# Altium schematic sheet Sheet1_wiekszy.SchDoc
size A3; SheetNumber: 1; SheetTotal: 2
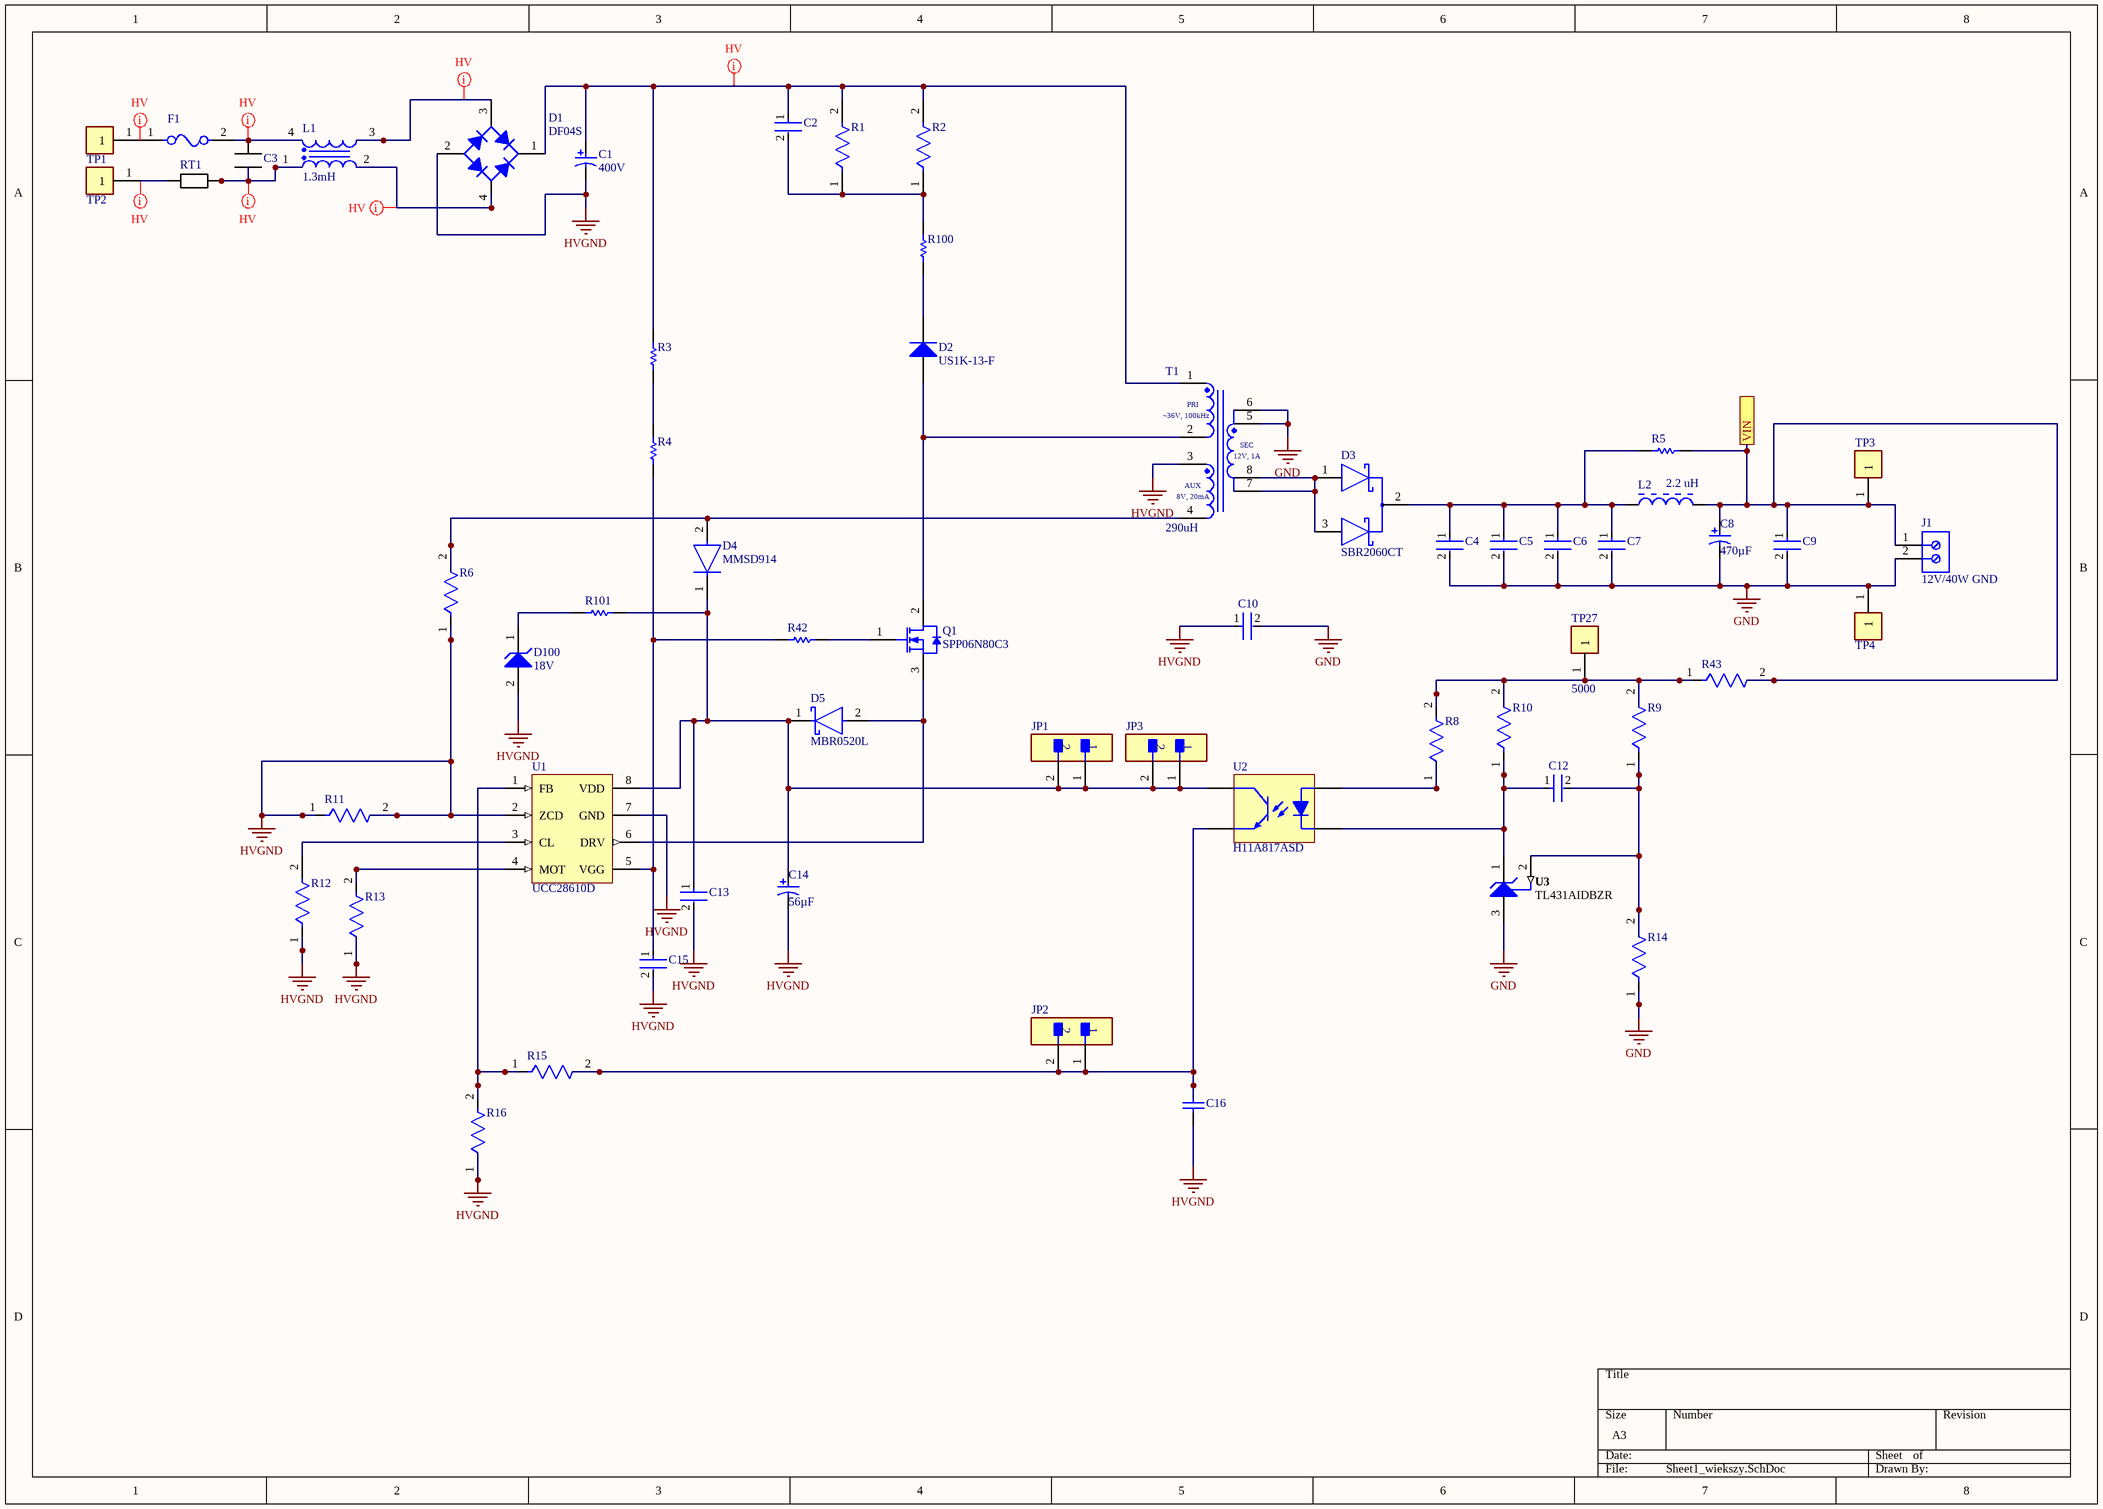
[diagram p0: Sheet1_wiekszy.SchDoc]

## Parts
C1  400V  [NIC-LGU-30x30-2_V]
C2  C1206C103K2RACTU  [FP-C1206C-EB-MFG]  (value not drawn)
C3  cap_0.689 x 0.217  [PCBComponent_1]  (value not drawn)
C4  1210YD226KAT2A  [FP-1210-L_3_3_0_4-W_2_5_0-MFG]  (value not drawn)
C5  1210YD226KAT2A  [FP-1210-L_3_3_0_4-W_2_5_0-MFG]  (value not drawn)
C6  1210YD226KAT2A  [FP-1210-L_3_3_0_4-W_2_5_0-MFG]  (value not drawn)
C7  1210YD226KAT2A  [FP-1210-L_3_3_0_4-W_2_5_0-MFG]  (value not drawn)
C8  Capacitance: 470µF  [PNSC-FK-V-F_V]  (hidden comment: EEEFK1C471P)
C9  C0603X104K5RACTU  [FP-C0603-CJ-MFG]  (value not drawn)
C10  (no value)  [FP-CL31-IPC_C]
C12  CC0603KRX7R9BB223  [FP-CC0603-DA-MFG]  (value not drawn)
C13  C0603X104K5RACTU  [FP-C0603-CJ-MFG]  (value not drawn)
C14  Capacitance: 56µF  [PNSC-FK-V-F_V]  (hidden comment: EEEFK1C471P)
C15  C0603X104K5RACTU  [FP-C0603-CJ-MFG]  (value not drawn)
C16  GRM1885C1H101JA01D  [CAPC1608X90X35NL10T15]  (value not drawn)
D1  DF04S  [FAIR-SDIP-4_V]
D2  US1K-13-F  [DIOD-SMA-2_A_V]
D3  SBR2060CT  [FP-340CC-MFG]
D4  MMSD914  [FP-425-04-MFG]
D5  MBR0520L  [FP-MA02A-MFG]
D100  18V  [ONSC-SMB-2-403A-03_H_V]
F1  0154004.DR  [FP-0154-MFG]  (value not drawn)
J1  12V/40W GND  [TECO-282836-2_V]
JP1  M22-2510205  [FP-M22-2510205-MFG]  (value not drawn)
JP2  M22-2510205  [FP-M22-2510205-MFG]  (value not drawn)
JP3  M22-2510205  [FP-M22-2510205-MFG]  (value not drawn)
L1  1.3mH  [WE-CMB_Type XXL_L43.5W23.5H43]
L2  Inductance: 2.2 uH  [COIL-RFB0807-2_V]  (hidden comment: RFB0807-2R2L)
Q1  SPP06N80C3  [INF-PG-TO220-3-1]
R1  CRCW2512249KFKEG  [FP-CRCW2512-e3-MFG]  (value not drawn)
R2  CRCW2512249KFKEG  [FP-CRCW2512-e3-MFG]  (value not drawn)
R3  CRCW12063M00FKEA  [RESC3216X60X45ML10T20]  (value not drawn)
R4  CRCW12063M00FKEA  [RESC3216X60X45ML10T20]  (value not drawn)
R5  ERJ14BQFR22U  [RESC3225X70X50ML20T20]  (value not drawn)
R6  RR0816P-1693-D-23D  [FP-RR0816-IPC_A]  (value not drawn)
R8  RR0816P-4991-D-68H  [FP-RR0816-MFG]  (value not drawn)
R9  RR0816P-103-D  [FP-RR0816-MFG]  (value not drawn)
R10  RR0816P-202-D  [FP-RR0816-IPC_A]  (value not drawn)
R11  RR0816P-4992-D-68C  [FP-RR0816-IPC_B]  (value not drawn)
R12  RR0816P-6042-D-76C  [FP-RR0816-IPC_C]  (value not drawn)
R13  RR0816P-104-D  [FP-RR0816-IPC_A]  (value not drawn)
R14  RR0816P-2611-D-41H  [FP-RR0816-IPC_C]  (value not drawn)
R15  RR0816P-203-D  [FP-RR0816-MFG]  (value not drawn)
R16  RR0816P-104-D  [FP-RR0816-IPC_A]  (value not drawn)
R42  CRCW08050000Z0EA  [RESC2013X50X30LL20T20]  (value not drawn)
R43  CRCW06030000Z0EAHP  [FP-CRCW0603-HPe3-MFG]  (value not drawn)
R100  CRCW120651R1FKEA  [RESC3216X60X45NL10T20]  (value not drawn)
R101  RG3216P-8200-B-T1  [RESC3216X50X50LL20T20]  (value not drawn)
RT1  Thermistor  [PCBComponent_1]  (value not drawn)
T1  290uH  [WE-FB_EP10]
TP1  5000  [FP-5000-MFG]  (value not drawn)
TP2  5000  [FP-5000-MFG]  (value not drawn)
TP3  5000  [FP-5000-MFG]  (value not drawn)
TP4  5000  [FP-5000-MFG]  (value not drawn)
TP27  5000  [FP-5000-MFG]
U1  UCC28610D  [D0008A_N]
U2  H11A817ASD  [FAIR-H11A817ASD-4_V]
U3  TL431AIDBZR  [DBZ0003A_L]

## Ports
VIN (see Sheet1[3A], Sheet1[3B], Sheet1[5C], Sheet1[7A], Sheet1[7B])

## Nets
GND: C4.2 C5.2 C6.2 C7.2 C8.2 C9.2 C10.2 J1.2 R14.1 T1.5 T1.6 TP4.1 U3.3(ANODE)
HVGND: C1.2 C10.1 C13.2 C14.2 C15.2 C16.1 D1.2(A) D100.2(A) R6.1 R11.1 R11.2 R12.1 R13.1 R16.1 T1.3 U1.2(ZCD) U1.7(GND)
VIN: C8.1 C9.1 J1.1 L2.2 R5.2 R43.2 TP3.1 ; port VIN
NetC1_1: C1.1 C2.1 D1.1(K) R1.2 R2.2 R3.2 T1.1
NetC2_2: C2.2 R1.1 R2.1 R100.2
NetC3_1: C3.1 L1.1 RT1.2
NetC3_2: C3.2 F1.2 L1.4
NetC4_1: C4.1 C5.1 C6.1 C7.1 D3.2(COMMON_CATHODE) L2.1 R5.1
NetC12_1: C12.1 R10.1 U2.2(CATHODE) U3.1(CATHODE)
NetC12_2: C12.2 R9.1 R14.2 U3.2(REF)
NetC13_1: C13.1 C14.1 D4.1(C) D5.1(C) JP1.1 JP1.2 JP3.1 JP3.2 R101.2 U1.8(VDD) U2.4(COLLECTOR)
NetC15_1: C15.1 R4.1 R42.1 U1.5(VGG)
NetC16_2: C16.2 JP2.1 JP2.2 R15.2 U2.3(EMITTER)
NetD1_3: D1.3(C) L1.3
NetD1_4: D1.4(C) L1.2
NetD2_1: D2.1(A) Q1.2(DRAIN) T1.2
NetD2_2: D2.2(K) R100.1
NetD3_1: D3.1(1_ANODE) D3.3(2_ANODE) T1.7 T1.8
NetD4_2: D4.2(A) R6.2 T1.4
NetD5_2: D5.2(A) Q1.3(SOURCE) U1.6(DRV)
NetD100_1: D100.1(K) R101.1
NetF1_1: F1.1 TP1.1
NetQ1_1: Q1.1(GATE) R42.2
NetR3_1: R3.1 R4.2
NetR8_1: R8.1 U2.1(ANODE)
NetR8_2: R8.2 R9.2 R10.2 R43.1 TP27.1
NetR12_2: R12.2 U1.3(CL)
NetR13_2: R13.2 U1.4(MOT)
NetR15_1: R15.1 R16.2 U1.1(FB)
NetRT1_1: RT1.1 TP2.1

## Layout directives
rule Clearance Constraint [Clearance = 49.213mil]: NetC1_1, NetC3_1, NetC3_2, NetD1_3, NetD1_4, NetF1_1, NetRT1_1

## Notes on the sheet
- (in symbol CMP-1360-00018-2) ~36V, 100kHz; PRI; SEC; 12V, 1A; AUX; 8V, 20mA

## Library data of the parts
C1 = CMP-1233-00001-1: Aluminum Electrolytic Capacitor, 180 uF +/-20%, 400 V, -25 to 105 degC, 2-Pin THD, RoHS; PartNumber: LGU2G181MELB; Manufacturer: Nichicon; Rated Capacitance: 180 uF; Rated Ripple: 980 mA; Leakage Current: 0.8 mA; ComponentLink2URL: http://nichicon-us.com/english/products/pdfs/e-gu.pdf; DatasheetVersion: Sep-13; ComponentLink1Description: Manufacturer URL; Rated Voltage: 400 V; PackageDescription: 2-Pin Through Hole Device, Dia 30 mm, Body Length 30 mm, Pin Spacing 10 mm; ComponentLink1URL: http://www.nichicon.co.jp/; Mounting Technology: Through Hole; ComponentLink2Description: Datasheet; ComponentLink3URL: http://nichicon-us.com/english/products/pdfs/e-gu.pdf; RoHS: TRUE; Temperature Range: -25 to 105 degC; Capacitance Tolerance: +/-20%; ComponentLink3Description: Package Specification
C2 = CMP-1037-03529-2: CAP CER 10000PF 200V X7R 1206; Manufacturer: KEMET; Value: 10,000 pF; Automotive Grade: Grade 0; Temperature Coefficient: 15%; Material: Ceramic; Tolerance: 0.1; Temperature Range High: +150°C; Category: Cap; Device Class L2: Capacitors; Temperature Range Low: -55°C; Temperature Characteristic: X7R; Lead Free: Yes; Octopart: https://octopart.com/c1206c103k2ractu-kemet-2299149; Device Class L1: Passive Components; RoHS: TRUE; Mouser Description: Multilayer Ceramic Capacitors MLCC - SMD/SMT 200volts 10000pF X7R 10%; Temperature: -55°C to +150°C; Voltage Rating: 200 V; ComponentLink2URL: https://content.kemet.com/datasheets/KEM_C1007_X8R_ULTRA_150C_SMD.pdf; Ipc Land Pattern Name: CAPC320160X78; Automotive: Yes; Device Class L3: Ceramic Capacitors; Manufacturer Part Number: C1206C103K2RACTU; Digikey Description: CAP CER 10000PF 200V X7R 1206; Capacitance: 10,000 pF; Package: C1206C-EB; ComponentLink2Description: Datasheet; Height: 0.88mm
C3 = cap_0.689 x 0.217: 0.22 uF Capacitor, Film, 250VAC, 20%; Manufacturer: Panasonic; Manufactured Part Number: STD; Tolerance: 20%; Package Size: 0.689 x 0.217; Voltage Rating: 250VAC
C4-C7 = CMP-2000-05483-2: General Purpose Ceramic Capacitor, 1210, 22uF, 10%, X5R, 15%, 16V; Tolerance: 10%; Width: 0.098inch; Length: 3.2mm; Min Operating Temperature: -55°C; Capacitance: 22uF; Case/Package: 1210; Termination: SMD/SMT; Voltage: 16V; Number of Pins: 2; Thickness: 0.11inch; Height: 2.79mm; Weight: 0.000564oz; Case Code (Imperial): 1210; Contact Plating: Tin; Lead Free: Lead Free; RoHS Compliant: Yes; Packaging: Tape and Reel; Package Quantity: 1; Construction: Flat; Series: -; REACH SVHC: No SVHC; Case Code (Metric): 3225; Size: 2.79mm; Radiation Hardening: No; Voltage Rating: 16V; Depth: 2.5mm; Mount: Surface Mount; Voltage Rating (DC): 16V; Dielectric: X5R; Max Operating Temperature: 85°C
C8 C14 = CMP-2000-06204-1: Aluminum Electrolytic Capacitor, 470 uF, +/- 20%, 16 V, 2-Pin SMD (Size Code F), -55 to 105 degC, RoHS, Tape and Reel; Manufacturer: Panasonic; Type: Can; Ripple Current: 600mA; Lifetime@Temperature: 2000Hrs@105°C; Impedance: 0.16O; Rated Voltage: 16V; Manufacturer URL: http://www.panasonic.com/; Package Description: 2-Pin Electrolytic Aluminum Capacitor, Body 8.3 x 8.3 mm; Operating Temp-Max: 105°C; Mounting Technology: SurfaceMount; Operating Temp Range: -55to+105°C; Datasheet Version: 03/2016; Series: FK; Package Reference: FK-V-F; Case Size/Dimension: Ø8x10.2mm; Package URL: http://industrial.panasonic.com/cdbs/www-data/pdf/RDE0000/DME0000COL48.pdf; Datasheet URL: http://industrial.panasonic.com/cdbs/www-data/pdf/RDE0000/ABA0000C1181.pdf
C9 C13 C15 = CMP-2006-03300-2: CAP CER 0.1UF 50V X7R 0603; Manufacturer: Kemet; Capacitance: 100nF; Material: Ceramic; Tolerance: 10%; Value: 100nF; Temperature Coefficient: 15%; Temperature Range High: +125°C; Temperature Range Low: -55°C; Manufacturer Part Number: C0603X104K5RACTU; Voltage: 50V; ComponentLink2Description: Datasheet; RoHS: TRUE; ComponentLink2URL: https://content.kemet.com/datasheets/KEM_C1013_X7R_FT-CAP_SMD.pdf; Device Class L3: Ceramic Capacitors; Device Class L2: Capacitors; Package: C0603-CJ; Height: 0.95mm; Device Class L1: Passive Components; Temperature Characteristic: X7R; Lead Free: Yes; Digikey Description: CAP CER 0.1UF 50V X7R 0603; Automotive: No; Mouser Description: Capacitor; Ceramic; Cap 0.1uF; Tol+10%; SMT; Flexible Termination; Vol-Rtg 50V; TR; Temperature: -55°C to +125°C; Octopart: https://octopart.com/c0603x104k5ractu-kemet-9145062; Category: Cap; Voltage Rating: 50V; Ipc Land Pattern Name: CAPC16080X80
C10 = CMP-13271-001384-1: Cap Ceramic 1.5nF 500V X7R ±10% SMD 1206 +125°C Embossed T/R; Max Operating Temperature: 125°C; Radiation Hardening: No; Width: 0.063inch; Dielectric: X7R; Case Code (Metric): 3216; Length: 3.2mm; Voltage Rating (DC): 500V; Package Quantity: 1; Voltage Rating: 500V; Mount: Surface Mount; Min Operating Temperature: -55°C; Case Code (Imperial): 1206; Packaging: Tape and Reel; Capacitance: 1.5nF; Voltage: 500V; Thickness: 0.055inch; Case/Package: 1206; Height: 1.25mm; Depth: 1.6mm; Tolerance: 10%
C12 = CMP-2100-03602-3: CAP CER 0.022UF 50V X7R 0603; Dielectric Material: Ceramic; Insulation Resistance: 100GR; Tolerance: 10%; Capacitance: 22nF; Thickness: 0.035inch; Case/Package: 0603; Packaging: Tape and Reel; Voltage Rating (DC): 50V; Length: 1.6mm; Depth: 0.8mm; Dielectric: X7R; Resistor Type: Ceramic; Min Operating Temperature: -55°C; Number of Pins: 2; Series: CC; Mount: Surface Mount; Max Operating Temperature: 125°C; Case Code (Imperial): 0603; Width: 0.031inch; Halogen Free: Halogen Free; Lead Free: Lead Free; Voltage: 50V; RoHS Compliant: Yes; Package Quantity: 1; Height: 0.8mm; REACH SVHC: No SVHC; Voltage Rating: 50V; Case Code (Metric): 1608; Termination: SMD/SMT; Radiation Hardening: No
C16 = CMP-2006-02595-1: Manufacturer: Murata; Part Number: GRM1885C1H101JA01D
D1 = CMP-2000-06151-1: Bridge Rectifier, 1.5 A, 400 V, -55 to 150 degC, 4-Pin SMD, RoHS, Tape and Reel; Vf - Forward Voltage: 1.1V; Vr - Reverse Voltage: 280V; Max Surge Current: 50A; Peak Reverse Voltage: 400V; Brand: FairchildSemiconductor; Pd - Power Dissipation: 3.1W; If - Forward Current: 1.5A; Unit Weight: 0.017073oz; Ir - Reverse Current: 50uA; Minimum Operating Temperature: -55C; Datasheet URL: https://www.fairchildsemi.com/datasheets/DF/DF005S.pdf; Product: SinglePhaseBridge; Maximum Operating Temperature: +150C; Datasheet Version: Rev. 1.5 , 05/2015; Product Category: BridgeRectifiers; Packaging: Reel; Length: 8.5mm; Mounting Technology: SurfaceMount; Package Reference: SDIP 4L; Package Description: 4-Pin Surface Mount Device, Body 8.28 x 6.35 mm, Pitch 5.1 mm; Manufacturer: FairchildSemiconductor; Mounting Style: ThroughHole; Package / Case: SDIP-4; RoHS: True; Height: 3.3mm; Manufacturer URL: https://www.fairchildsemi.com/; Width: 6.5mm
D2 = CMP-1667-00001-4: Ultra-Fast Rectifier, 1 A, 1.7 V, -65 to 150 degC, 2-Pin SMD, RoHS, Tape and Reel; Manufacturer: Diodes Inc; ComponentLink2Description: Datasheet; PackageDescription: 2-Pin Surface Mount Device, Body 4.3 x 2.605 mm; Height: 2.1 mm; REACH SVHC: Yes; RoHSCompliant: true; Min Operating Temperature: -65 degC; Pins: 2; Packaging: Cut Tape; ComponentLink2URL: http://www.diodes.com/_files/datasheets/ds16008.pdf; Package Quantity: 1; Length: 4.6 mm; Max Operating Temperature: 150 degC; ComponentLink1URL: http://www.diodes.com/; ComponentLink1Description: Manufacturer URL; DatasheetVersion: Rev. 11-2, 12/2014; PackageReference: SMA-2; Mount: Surface Mount; Mounting Technology: Surface Mount
D3 = CMP-00278-84329774-2: MBR3060PT Rectifier Diode, Schottky, 1 Phase, 2 Element, 30A, 60V V(RRM), Silicon, TO-247AD; Manufacturer Lifecycle Status: OBSOLETE; Peak Non-Repetitive Surge Current: 200A; Forward Voltage: 750mV; Max Reverse Leakage Current: 5mA; Element Configuration: Common Cathode; Max Junction Temperature (Tj): 150°C; Mount: Through Hole; NexarPartId: 84329774; Weight: 5.508g; RoHS: Compliant; Width: 5.22mm; Max Operating Temperature: 150°C; Lead Free: Lead Free; Max Forward Surge Current (Ifsm): 200A; Lifecycle Status: Obsolete; Max Repetitive Reverse Voltage (Vrrm): 60V; Number of Pins: 3; Average Rectified Current: 30A; REACH SVHC: No SVHC; Peak Reverse Current: 5mA; Length: 16.4mm; Radiation Hardening: No; Max Reverse Voltage (DC): 60V; Voltage Rating (DC): 60V; Min Operating Temperature: -65°C; Forward Current: 30A; Height: 21.3mm; Current Rating: 30A; Max Surge Current: 200A
D4 = CMP-00278-20848306-1: MMSD914 Rectifier Diode Small Signal Switching 100V 0.2A 4ns 2-Pin SOD-123 T/R; Manufacturer Lifecycle Status: LAST SHIPMENTS; Max Surge Current: 2A; Average Rectified Current: 200mA; Power Dissipation: 400mW; Forward Voltage: 1V; Element Configuration: Single; Peak Reverse Current: 5µA; Polarity: Standard; Max Junction Temperature (Tj): 150°C; Max Forward Surge Current (Ifsm): 500mA; Capacitance: 4pF; Min Operating Temperature: -55°C; Max Operating Temperature: 150°C; Termination: SMD/SMT; Schedule B: 8541100070; Recovery Time: 4ns; Output Current: 200mA; Voltage Rating (DC): 100V; Number of Pins: 2; Mount: Surface Mount; Max Reverse Voltage (DC): 100V; NexarPartId: 20848306; REACH SVHC: No SVHC; Reverse Voltage: 100V; RoHS: Compliant; Max Repetitive Reverse Voltage (Vrrm): 100V; Weight: 30mg; Contact Plating: Tin; Lead Free: Lead Free; Height: 1.18mm; Width: 1.8mm; Reverse Recovery Time: 4ns; Lifecycle Status: EOL; Length: 2.85mm; Packaging: Tape & Reel; Forward Current: 200mA; Current Rating: 200mA; Peak Non-Repetitive Surge Current: 2A; Radiation Hardening: No
D5 = CMP-2000-04926-2: DIODE SCHOTTKY 20V 500MA SOD123; Current Rating: 500A; Peak Non-Repetitive Surge Current: 5.5A; Peak Reverse Current: 250uA; Power Dissipation: 400mW; Polarity: Standard; Element Configuration: Single; Capacitance: 4pF; Forward Voltage: 385mV; Voltage Rating (DC): 20V; Max Reverse Voltage (DC): 20V; Packaging: Tape and Reel; Min Operating Temperature: -65°C; Max Repetitive Reverse Voltage (Vrrm): 20V; Forward Current: 500mA; Max Operating Temperature: 125°C; Width: 1.6mm; Height: 1.03mm; Max Forward Surge Current (Ifsm): 5.5A; Mount: Surface Mount; Max Reverse Leakage Current: 250uA; Weight: 0.03g; Package Quantity: 3000; Max Surge Current: 5.5A; Radiation Hardening: No; REACH SVHC: No SVHC; Average Rectified Current: 500mA; Output Current: 500mA; Length: 2.7mm; Number of Pins: 2; Lead Free: Lead Free
D100 = CMP-1060-00156-1: 3 W Zener Voltage Regulator, 2-Pin SMB, Tape and Reel; Manufacturer: On Semiconductor; PartNumber: 1SMB5931BT3; VZ Typ (V): 18; ComponentLink1Description: Manufacturer URL; DatasheetVersion: Rev. 8; Mounting Technology: Surface Mount; ComponentLink2Description: Datasheet; PackageVersion: Rev. H, 05/2011; ComponentLink1URL: http://www.onsemi.com/; Packing: Tape and Reel; ComponentLink3URL: http://www.onsemi.com/pub_link/Collateral/1SMB5913BT3-D.PDF; ComponentLink2URL: http://www.onsemi.com/pub_link/Collateral/1SMB5913BT3-D.PDF; PackageReference: SMB-2-403A-03_H; ComponentLink3Description: Package Specification; PackageDescription: 2-Pin Small Molded Package, J-Bend Lead, Body 4.33 x 3.625 mm
F1 = CMP-08605-000003-1: FUSE BRD MNT 4A 125VAC/VDC 2SMD; Manufacturer: Littelfuse; Fuse Blow Speed: Fast; Max Fuse Ac Voltage: 125V; Lead Free: Yes; Device Class L3: unset; Manufacturer Part Number: 0154004.DR; Device Class L2: Fuses; Package: 0154; ComponentLink2Description: Datasheet; Temperature Range Low: -55°C; Temperature Range High: +125°C; Device Class L1: Circuit Protection; Height: 3.81mm; Temperature: -55°C to +125°C; Mouser Description: Surface Mount Fuses Fuseblock w/ fuse 4A OMNI BLOK 154; Automotive: No; Digikey Description: FUSE BRD MNT 4A 125VAC/VDC 2SMD; RoHS: TRUE; Category: Fuse; Fuse Current: 4A; Max Fuse Dc Voltage: 125V; ComponentLink2URL: https://www.littelfuse.com/~/media/electronics/datasheets/fuses/littelfuse_fuse_154_154t_154l_154tl_datasheet.pdf.pdf; Octopart: https://octopart.com/0154004.dr-littelfuse-565861
J1 = CMP-1684-00017-1: Female Header, Pitch 5 mm, 1 x 2 Position, Height 10 mm, Tail Length 3.5 mm, Rohs, Bulk; Manufacturer: TE Connectivity; Wire Gauge: 16-30AWG; Product Training Modules: Wire-to-BoardEurostyleTerminalBlocks; Clamp Material - Plating: Brass-NickelPlated; Voltage: 300V; Mating Orientation: HorizontalwithBoard; Current: 13.5A; Pitch: 0.197"(5.00mm); Screw Thread: M3; 3D Model: 282836-2.pdf; Other Names: 5ULV-02B / A98076; Dynamic Catalog: BuchananSeries; Number of Levels: 1; Torque - Screw: 0.68Nm(6Lb-In); Featured Product: EurostyleTerminalBlockConnectors; Positions Per Level: 2; Wire Termination: Screw-RisingCageClamp; Datasheet URL: http://www.te.com.cn/commerce/DocumentDelivery/DDEController?Action=showdoc&DocId=Catalog+Section%7F1308389_EUROSTYLE_TERMINAL_BLOCKS%7F0607%7Fpdf%7FEnglish%7FENG_CS_1308389_EUROSTYLE_TERMINAL_BLOCKS_0607.pdf%7F282836-2; Color: Green; Family: TerminalBlocks-WiretoBoard; RoHS Information: 282836-2StatementofCompliance; Standard Package: 300; Contact Material - Plating: Brass-TinPlated; Manufacturer URL: http://www.te.com; Housing Material: Polyamide(PA66),Nylon6/6; Features: Interlocking(Side); Package Description: Female Header, Pitch 5 mm, 1 x 2 Position, Height 10 mm, Tail Length 3.5 mm; Mounting Type: ThroughHole; Package Reference: THD; Packaging: Bulk; Series: Buchanan; Category: Connectors,Interconnects; Screw Material - Plating: Brass-NickelPlated
JP1-JP3 = CMP-15831-000005-1: CONN HEADER VERT 2POS 2MM; Manufacturer: Harwin; Conn Gender: Male; Current Rating: 2A; Number Of Contacts: 2; Conn Orientation: Vertical; Temperature Range Low: -40°C; Device Class L1: Connectors; ComponentLink2URL: https://cdn.harwin.com/pdfs/C018XX_M22_Series_Connectors.pdf; Temperature Range High: +105°C; Pitch: 2mm; Number Of Rows: 1; Temperature: -40°C to +105°C; Automotive: No; Device Class L3: unset; Octopart: https://octopart.com/m22-2510205-harwin-2538221; Mouser Description: Headers & Wire Housings 2 PIN SIL VERTICAL GOLD PIN HEADER; Height: 5.45mm; Category: Conn; Digikey Description: CONN HEADER VERT 2POS 2MM; Contact Material: Gold,Nickel; Lead Free: Yes; ComponentLink2Description: Datasheet; Manufacturer Part Number: M22-2510205; Device Class L2: Headers and Wire Housings; Package: 0; Footprint Url: https://cdn.harwin.com/pdfs/M22-251.pdf; RoHS: TRUE
L1 = CMP-0223-00119-2: NexarPartId: 8917427; Resistance: 6.2MΩ; Number of Lines: 2; Pin Length: 3mm; Self Resonant Frequency: 10kHz; Lead Diameter: 1.8mm; Current: 20A; Tolerance: 30%; Series Resistance: 4.7mΩ; Test Frequency: 50Hz; Core Material: Ferrite; Voltage Rating: 250V; REACH SVHC: No SVHC; Width: 23.5mm; Mount: Radial, Through Hole; Ambient Temperature Range Low: -40°C; Number of Pins: 4; Depth: 23.5mm; Termination: Radial; Ambient Temperature Range High: 70°C; DC Resistance (DCR): 6.2mΩ; Max Operating Temperature: 125°C; Min Operating Temperature: -40°C; Inductance Tolerance: 30%; Height: 43mm; Case/Package: Radial; Max DC Current: 20A; Inductance: 1.3mH; Lead Pitch: 10mm; RoHS: Compliant; Current Rating: 20A; Length: 43.5mm
L2 = CMP-0924-00033-1: Power Inductor, 2.2 uH +/- 20%, 6 A, -40 to 125 degC, 2-Pin Radial Leaded, Dia 8.8 mm, RoHS, Tray; Manufacturer: Coilcraft; SRF: 80 MHz Typ.; Tolerance: +/- 20%; DCR: 0.012 Ohm Max.; Isat: 6 A; Irms Rise (40 degC): 7.5 A; Irms Rise (20 degC): 5 A; ComponentLink1URL: http://www.coilcraft.com/; PackageDescription: 2-Pin Radial Leaded, Dia 8.8 mm, Height 7.5 mm, Pin Spacing 5 mm; ComponentLink1Description: Manufacturer URL; PartNumber: RFB0807-2R2L; Mounting Technology: Through Hole; ComponentLink2Description: Datasheet; Ambient Temperature Range: -40 to 125 degC; ComponentLink2URL: http://www.coilcraft.com/pdfs/rfb.pdf; RoHS: TRUE; DatasheetVersion: Sep-13; Packing: Tray; PackageReference: RFB0807-2
Q1 = CMP-1165-00007-1: N-Channel CoolMOS Power-Transistor, 800 V VDS, 6 A ID, -55 to 150 degC, PG-TO220-3-1, Tube, Green; Manufacturer: Infineon; RDS (on) (max): 900Â mOhm; ID (max): 6Â A; QG: 31Â nC; Ptot (max): 83Â W; VGS(th) (max): 3.9Â V; VDS (max): 800Â V; RthJA (max): 62Â K/W; Rth: 1.5Â K/W; VGS(th) (min): 2.1Â V; Polarity: N; IDpuls (max): 18Â A; Packing: Tube; ComponentLink2URL: http://www.infineon.com/dgdl/SPP06N80C3_rev2.91.pdf?folderId=db3a3043163797a6011638491238009b&fileId=db3a30432313ff5e0123a8fd3e665c78; PackageDescription: 3-Pin Plastic (Green) Transistor Single Outline Package, 10 x 9.25 mm Body, 2.54 mm Pitch; Mounting Technology: Through Hole; ComponentLink3Description: Package Specification; PartNumber: SPP06N80C3; Technology: CoolMOS C3; ComponentLink3URL: http://www.infineon.com/dgdl/BTS117_DS_14.pdf?folderId=db3a30431400ef68011421b54e2e0564&fileId=db3a30433a747525013abff8302d549c&location=en.Products.Automotive_ICs.Smart_High-_and_Low-Side_Switches.HITFET___TEMPFET__-_Smart_Low-Side_Switches.DATASHEET.BTS1; DatasheetVersion: Rev. 2.91; ComponentLink1URL: http://www.infineon.com/; ComponentLink2Description: Datasheet; PackageReference: PG-TO220-3-1; ComponentLink1Description: Manufacturer URL; RthJC (max): 1.5Â K/W; PackageVersion: Jul-12
R1 R2 = CMP-1018-00779-2: RES Thick Film, 249kΩ, 1%, 1W, 100ppm/°C, 2512; Voltage Rating: 500V; Resistance: 24.9kR; Power Rating: 500mW; Max Power Dissipation: 1W; Number of Pins: 2; Height: 0.028inch; Width: 0.124inch; Composition: Thick Film; Package Quantity: 2000; Case Code (Imperial): 2512; Voltage Rating (DC): 500V; Tolerance: 1%; Temperature Coefficient: 100ppm/°C; Features: Automotive AEC-Q200; Packaging: Cut Tape; Lead Free: Lead Free; Case Code (Metric): 6432; Case/Package: 2512; Length: 0.248inch; Number of Terminations: 2
R3 R4 = CMP-2003-02164-1: Manufacturer: Vishay Dale; Part Number: CRCW12063M00FKEA
R5 = CMP-2005-03801-1: Manufacturer: Panasonic; Part Number: ERJ14BQFR22U
R6 = CMP-28537-014398-1: 169kΩ ±0.5% 0.0625W 1/16W Chip Resistor 0603 (1608 Metric) Thin Film; Voltage Rating: 75V; Temperature Coefficient: 25ppm/°C; Max Power Dissipation: 63mW; Power Rating: 62.5mW; Resistance: 169kR; Package Quantity: 5000; Case/Package: 0603; Packaging: Tape and Reel; Case Code (Imperial): 0603; RoHS Compliant: Yes; Resistor Type: Thin Film; Min Operating Temperature: -55°C; Termination: SMD/SMT; Voltage Rating (DC): 75V; Case Code (Metric): 1608; Number of Terminations: 2; Max Operating Temperature: 125°C; Width: 0.031inch; Lead Free: Lead Free; Series: RR; Tolerance: 0.5%; Length: 0.063inch; Height: 0.02inch
R8 = CMP-2000-02681-2: 4.99kΩ ±0.5% 0.0625W 1/16W Chip Resistor 0603 (1608 Metric) Thin Film; Voltage Rating: 75V; Power Rating: 63mW; Temperature Coefficient: 25ppm/°C; Resistance: 4.99kR; Case Code (Metric): 1608; Tolerance: 0.5%; Resistor Type: Thin Film; Case Code (Imperial): 0603; Width: 0.031inch; Case/Package: 0603; RoHS Compliant: Yes; Number of Pins: 2; Packaging: Cut Tape; Lead Free: Lead Free; Number of Terminations: 2; Package Quantity: 1; Length: 0.063inch; Height: 0.02inch; Series: RR; Voltage Rating (DC): 75V; Size Code: 0603; Min Operating Temperature: -55°C; Resistance Tolerance: 0.5%; Max Power Dissipation: 63mW; Termination: SMD/SMT; Max Operating Temperature: 125°C
R9 = CMP-2000-02424-2: 10kΩ ±0.5% 0.0625W 1/16W Chip Resistor 0603 (1608 Metric) Thin Film; Max Power Dissipation: 63mW; Voltage Rating (DC): 75V; Resistance: 10kR; Temperature Coefficient: 25ppm/°C; Termination: SMD/SMT; Package Quantity: 1; Weight: 7.1E-05oz; Resistance Tolerance: 0.5%; Case Code (Metric): 1608; Height: 0.4mm; RoHS Compliant: Yes; Number of Terminations: 2; Max Operating Temperature: 125°C; Width: 0.8mm; Resistor Type: Thin Film; Packaging: Tape and Reel; Length: 1.6mm; Min Operating Temperature: -55°C; Depth: 0.8mm; Tolerance: 0.5%; Size Code: 0603; Case/Package: 0603; Number of Pins: 2; Voltage Rating: 75V; Case Code (Imperial): 0603; Lead Free: Lead Free; Power Rating: 63mW; Series: RR; Technology: THIN FILM
R10 = CMP-2000-02526-2: 2kΩ ±0.5% 0.0625W 1/16W Chip Resistor 0603 (1608 Metric) Thin Film; Temperature Coefficient: 25ppm/°C; Power Rating: 62.5mW; Voltage Rating: 75V; Resistance: 2kR; Max Power Dissipation: 63mW; Lead Free: Lead Free; Number of Terminations: 2; Case Code (Metric): 1608; Case Code (Imperial): 0603; Case/Package: 0603; Height: 0.02inch; Min Operating Temperature: -55°C; RoHS Compliant: Yes; Tolerance: 0.5%; Resistance Tolerance: 0.5%; Depth: 0.8mm; Termination: SMD/SMT; Length: 0.063inch; Width: 0.031inch; Series: RR; Size Code: 0603; Voltage Rating (DC): 75V; Package Quantity: 1; Packaging: Tape and Reel; Technology: THIN FILM; Resistor Type: Thin Film; Max Operating Temperature: 125°C
R11 = CMP-2000-02683-2: 49.9kΩ ±0.5% 0.0625W 1/16W Chip Resistor 0603 (1608 Metric) Thin Film; Voltage Rating (DC): 75V; Temperature Coefficient: 25ppm/°C; Power Rating: 62.5mW; Resistance: 49.9kR; Max Power Dissipation: 63mW; Tolerance: 0.5%; Max Operating Temperature: 125°C; Package Quantity: 1; Resistor Type: Thin Film; Case Code (Imperial): 0603; Lead Free: Lead Free; Case/Package: 0603; Length: 0.063inch; Number of Pins: 2; Height: 0.02inch; Technology: THIN FILM; Packaging: Tape and Reel; Series: RR; Voltage Rating: 75V; Min Operating Temperature: -55°C; RoHS Compliant: Yes; Number of Terminations: 2; Width: 0.8mm; Termination: SMD/SMT; Case Code (Metric): 1608; Working Voltage: 75V; Resistance Tolerance: 0.5%
R12 = CMP-2000-02712-2: 60.4kΩ ±0.5% 0.0625W 1/16W Chip Resistor 0603 (1608 Metric) Thin Film; Power Rating: 62.5mW; Temperature Coefficient: 25ppm/°C; Max Power Dissipation: 63mW; Voltage Rating: 75V; Resistance: 60.4kR; Weight: 7.1E-05oz; Min Operating Temperature: -55°C; Case Code (Imperial): 0603; Tolerance: 0.5%; Number of Terminations: 2; Max Operating Temperature: 125°C; Lead Free: Lead Free; Termination: SMD/SMT; Case Code (Metric): 1608; Size Code: 0603; Case/Package: 0603; Length: 0.063inch; Height: 0.02inch; Series: RR; Width: 0.8mm; Package Quantity: 1; RoHS Compliant: Yes; Resistor Type: Thin Film; Voltage Rating (DC): 75V; Packaging: Tape and Reel
R13 R16 = CMP-2000-02426-2: 100kΩ ±0.5% 0.0625W 1/16W Chip Resistor 0603 (1608 Metric) Thin Film; Resistance: 100kR; Max Power Dissipation: 63mW; Working Voltage: 75V; Temperature Coefficient: 25ppm/°C; Technology: THIN FILM; Width: 0.8mm; Length: 1.6mm; Number of Pins: 2; Case Code (Metric): 1608; Tolerance: 0.5%; Case Code (Imperial): 0603; Resistor Type: Thin Film; Voltage Rating (DC): 75V; Lead Free: Lead Free; Max Operating Temperature: 125°C; Series: RR; Voltage Rating: 75V; Termination: SMD/SMT; Depth: 0.8mm; Power Rating: 63mW; Min Operating Temperature: -55°C; Packaging: Tape and Reel; Height: 0.4mm; Package Quantity: 1; RoHS Compliant: Yes; Number of Terminations: 2; Resistance Tolerance: 0.5%; Case/Package: 0603
R14 = CMP-28537-016061-1: 2.61kΩ ±0.5% 0.0625W 1/16W Chip Resistor 0603 (1608 Metric) Thin Film; Max Power Dissipation: 63mW; Voltage Rating: 75V; Power Rating: 62.5mW; Resistance: 2.61kR; Temperature Coefficient: 25ppm/°C; Tolerance: 0.5%; Min Operating Temperature: -55°C; Case Code (Imperial): 0603; Resistor Type: Thin Film; Termination: SMD/SMT; Length: 0.063inch; Number of Terminations: 2; Package Quantity: 1; Weight: 7.1E-05oz; Voltage Rating (DC): 75V; Case/Package: 0603; Lead Free: Lead Free; RoHS Compliant: Yes; Size Code: 0603; Packaging: Tape and Reel; Series: RR; Case Code (Metric): 1608; Height: 0.02inch; Max Operating Temperature: 125°C; Width: 0.031inch
R15 = CMP-2000-02528-2: 20kΩ ±0.5% 0.0625W 1/16W Chip Resistor 0603 (1608 Metric) Thin Film; Working Voltage: 75V; Max Power Dissipation: 63mW; Temperature Coefficient: 25ppm/°C; Resistance: 20kR; Case/Package: 0603; Packaging: Tape and Reel; Number of Terminations: 2; Case Code (Imperial): 0603; Package Quantity: 1; Case Code (Metric): 1608; Lead Free: Lead Free; Height: 0.4mm; Width: 0.031inch; RoHS Compliant: Yes; Tolerance: 0.5%; Min Operating Temperature: -55°C; Resistor Type: Thin Film; Max Operating Temperature: 125°C; Number of Pins: 2; Voltage Rating (DC): 75V; Resistance Tolerance: 0.5%; Depth: 0.8mm; Series: RR; Power Rating: 63mW; Length: 1.6mm; Technology: THIN FILM; Termination: SMD/SMT; Voltage Rating: 75V
R42 = CMP-2001-04896-1: Manufacturer: Vishay Dale; Part Number: CRCW08050000Z0EA
R43 = CMP-2000-03817-2: RES Thick Film, 0Ω, , 0.33W, , 0603; Max Power Dissipation: 250mW; Voltage Rating (DC): 75V; Temperature Coefficient: 0ppm/°C; Resistance: 0mR; Mount: Surface Mount; Package Quantity: 5000; Features: Automotive AEC-Q200; Length: 1.6mm; Width: 0.033inch; Min Operating Temperature: -55°C; Max Operating Temperature: 155°C; Contact Plating: Tin; Depth: 0.85mm; Case/Package: 0603; Radiation Hardening: No; Military Standard: Not; Power Rating: 250mW; Height: 0.45mm; Composition: Thick Film; Lead Free: Lead Free; Voltage Rating: 75V; Case Code (Imperial): 0603; Weight: 7.1E-05oz; Number of Terminations: 2; Packaging: Tape and Reel; Number of Pins: 2; Case Code (Metric): 1608; Termination: SMD/SMT
R100 = CMP-2003-02265-1: Manufacturer: Vishay Dale; Part Number: CRCW120651R1FKEA
R101 = CMP-2003-02665-1: Manufacturer: Susumu; Part Number: RG3216P-8200-B-T1
RT1 = Thermistor: Manufactured: Epcos; Manufactured Part Number: B57153S0479M000; Package size: 0.590 x 0.276
T1 = CMP-1360-00018-2: NexarPartId: 19122518; Current Rating: 2.8A; Frequency: 100kHz; Output Voltage: 12V; Output Current: 1A; Min Input Voltage: 36V; Output Power: 12W; DC Resistance (DCR): 185mΩ; Isolation Voltage: 1.5kV; Turns Ratio: 3:1; Input Current: 4A; Inductance: 290µH; Min Operating Temperature: -40°C; Packaging: Digi-Reel®; Length: 13.34mm; Width: 15.24mm; Height - Seated (Max): 11.43mm; Max DC Current: 2.8A; Depth: 11.43mm; REACH SVHC: Unknown; RoHS: Compliant; Height: 11.43mm; Max Operating Temperature: 125°C; Mount: Surface Mount; Termination: SMD/SMT
TP1-TP4 TP27 = CMP-19636-000027-1: PC TEST POINT MINIATURE RED; Outside Diameter: 2.54mm; Body Material: Bronze; Number of Contacts: 1; Insulation: Insulated; Inside Diameter: 1.27mm; Hole Diameter: 1.6mm; Plating: Silver; Length: 7.62mm; Package Quantity: 100; Number of Ports: 1; Contact Material: Bronze; Orientation: Straight; RoHS Compliant: Yes; Housing Color: Red; Height: 0.3inch; Series: THM; Lead Free: Lead Free; Color: Red; Contact Plating: Tin; Mount: PCB; Packaging: Bulk; REACH SVHC: No SVHC; Flammability Rating: UL94 V-0; Material: Nylon
U1 = CMP-0319-00877-2: Green-Mode Flyback Power Supply Controller with Discontinuous Current Control, -40 to +125 degC, 8-pin SOIC (D), Green (RoHS & no Sb/Br); Manufacturer: Texas Instruments; Frequency(Max)(kHz): 130; SubFamily: PWM Controller; Rating: Catalog; PackageDescription: 8-Pin Plastic Small Outline Integrated Circuit, 4.9 x 3.9 mm, Pitch 1.27 mm Pitch; Eco-Plan: Green (RoHS & no Sb/Br); PackageReference: D0008A; ComponentLink1Description: Datasheet; Control Method: Discontinuous Current; PackageVersion: revM, Jun-2011; PartNumber: UCC28610D; Topology: Flyback; DatasheetVersion: SLUS888E; Mounting Technology: Surface Mount; ComponentLink1URL: http://www.ti.com/general/docs/lit/getliterature.tsp?genericPartNumber=UCC28610&fileType=pdf; UVLO Thresholds On/Off(V): 10.2/8; Code_JEDEC: MS-012AA
U2 = CMP-0949-00001-1: Phototransistor, 5300 Vrms, 80% to 160% CTR, -55 to 100 degC, 4-Pin SMD, Tape and Reel; Manufacturer: Fairchild Semiconductor; Emitter-Collector Voltage: 6 V; Reverse Voltage: 5 V; Collector-Emitter Voltage: 70 V Min.; Detector Power Dissipation: 150 mW; Continuous Collector Current: 50 mA; Forward Current - Peak: 1 A; Total Device Power Dissipation: 200 mW; Collector-Emitter Saturation Voltage: 0.2 V; LED Power Dissipation: 100 mW; ComponentLink1URL: http://www.fairchildsemi.com/; PackageReference: H11A817ASD-4; Current Transfer Ratio: 80% to 160%; Mounting Technology: Surface Mount; ComponentLink1Description: Manufacturer URL; Packing: Tape and Reel; PartNumber: H11A817ASD; Operating Temperature: -55 to 100 degC; Input-Output Isolation Voltage: 5300 Vrms; DatasheetVersion: Nov-03; PackageDescription: 4-Pin SMD, Body 6.605 x 4.64 mm, Pitch 2.54 mm; ComponentLink2Description: Unofficial Data Source; Continuous Forward Current: 50 mA; ComponentLink2URL: http://media.digikey.com/pdf/Data%20Sheets/Fairchild%20PDFs/H11A_A814,617,817.pdf
U3 = CMP-0366-01068-2: Adjustable Precision Shunt Regulator, 34 ppm / degC, 100 mA, -40 to 85 degC, 3-pin SOT-23 (DBZ), Green (RoHS & no Sb/Br); Manufacturer: Texas Instruments; Rating: Catalog; Iout/Iz(Max)(mA): 100; VO Adj(Min)(V): 2.495; VO Adj(Max)(V): 36; SubFamily: Shunt Voltage Reference; Temp Coeff(Max)(ppm/ degree C): 92; Initial Accuracy @ 25/deg C(%): 1; Min Iz for Regulation(uA): 600; Temp Coeff(Typ)(ppm/ degree C): 34; DatasheetVersion: SLVS543M; PackageDescription: 3-Pin Plastic Small Outline, Body 2.92 x 1.3 mm, Pitch 0.95 mm; ComponentLink3URL: http://www.ti.com/litv/pdf/mpds108a; ComponentLink2Description: Datasheet; ComponentLink3Description: Package Specification; PackageVersion: 4203227/B; ComponentLink1URL: http://www.ti.com/; Mounting Technology: Surface Mount; ComponentLink2URL: http://www.ti.com/general/docs/lit/getliterature.tsp?genericPartNumber=TL431A&fileType=pdf; PackageReference: DBZ0003A; Eco-Plan: Green (RoHS & no Sb/Br); PartNumber: TL431AIDBZR; ComponentLink1Description: Manufacturer URL; Code_JEDEC: TO-236